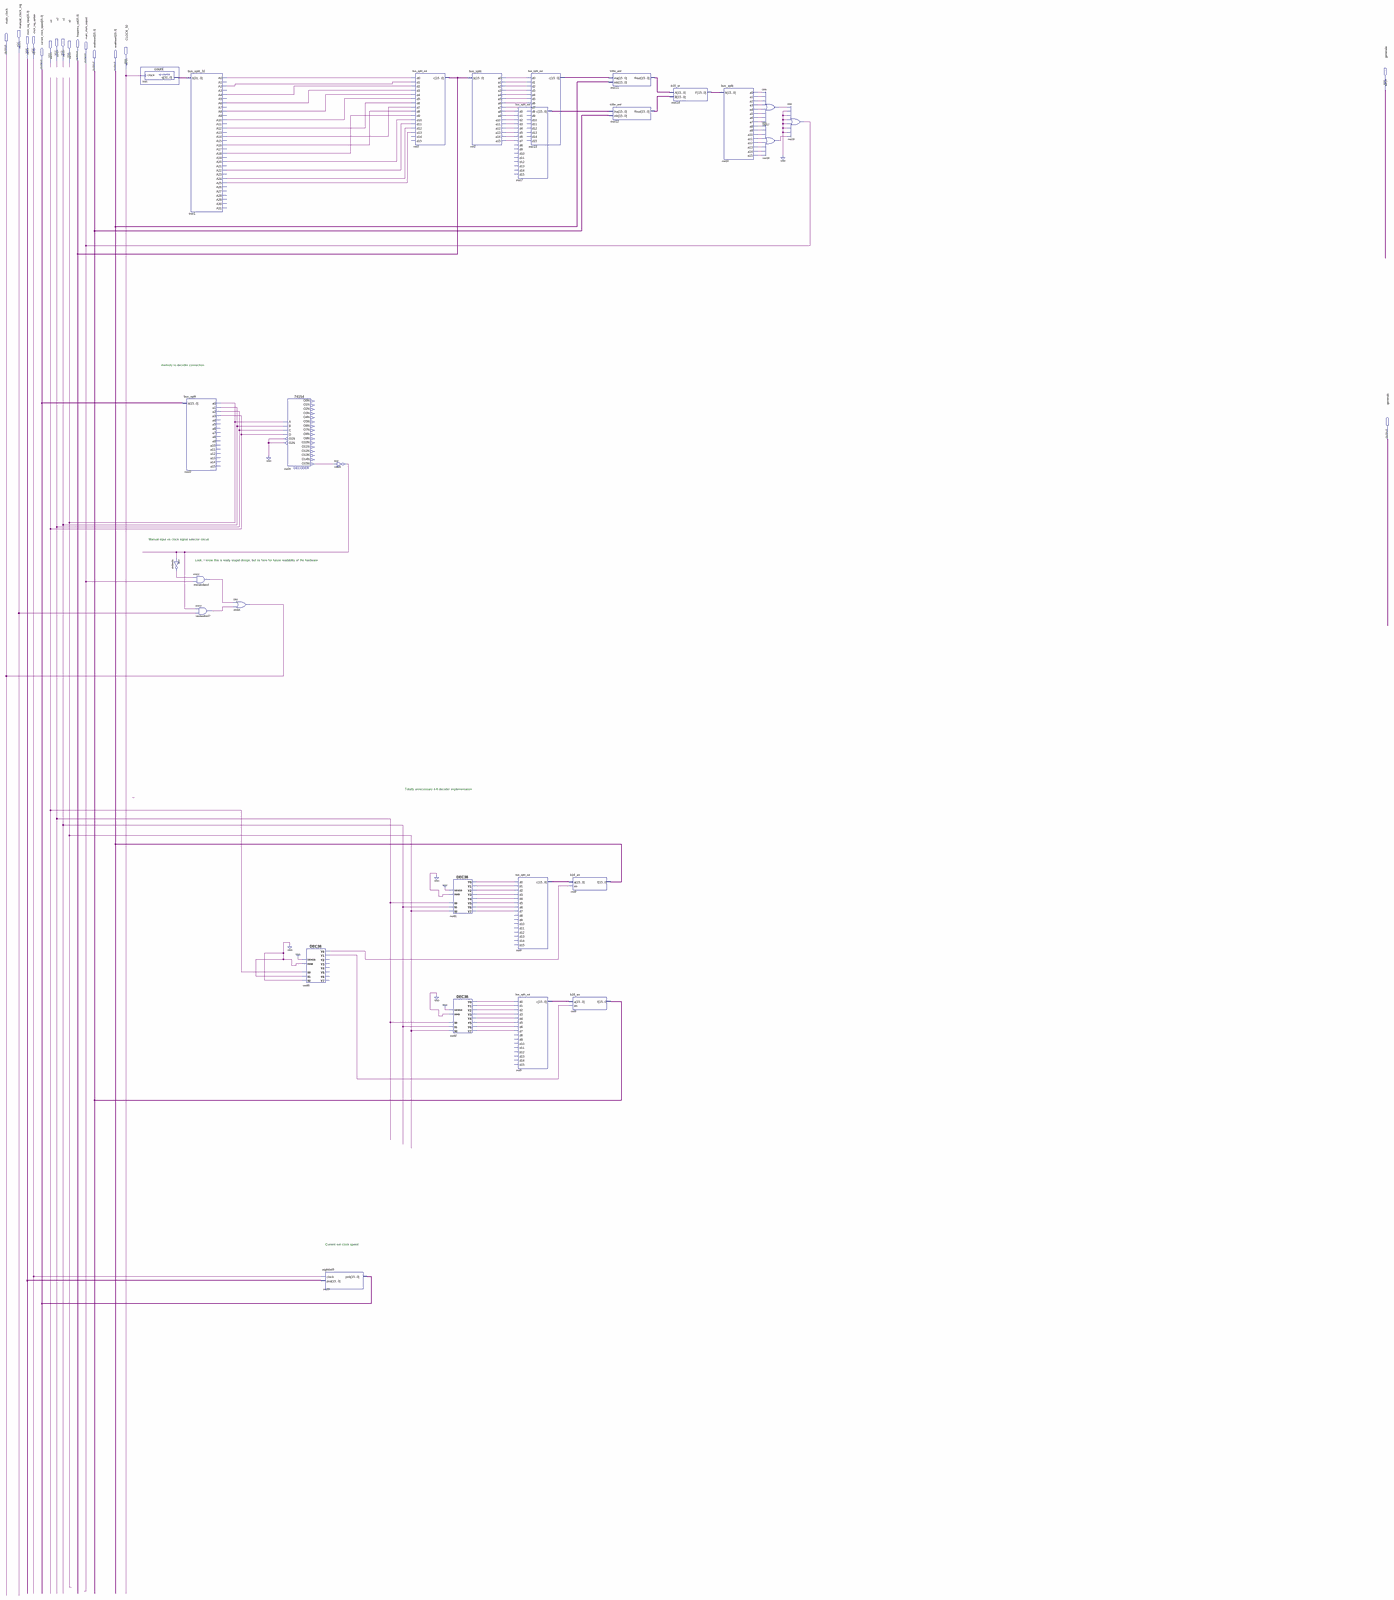
[diagram p0: schematic sheet, whole]
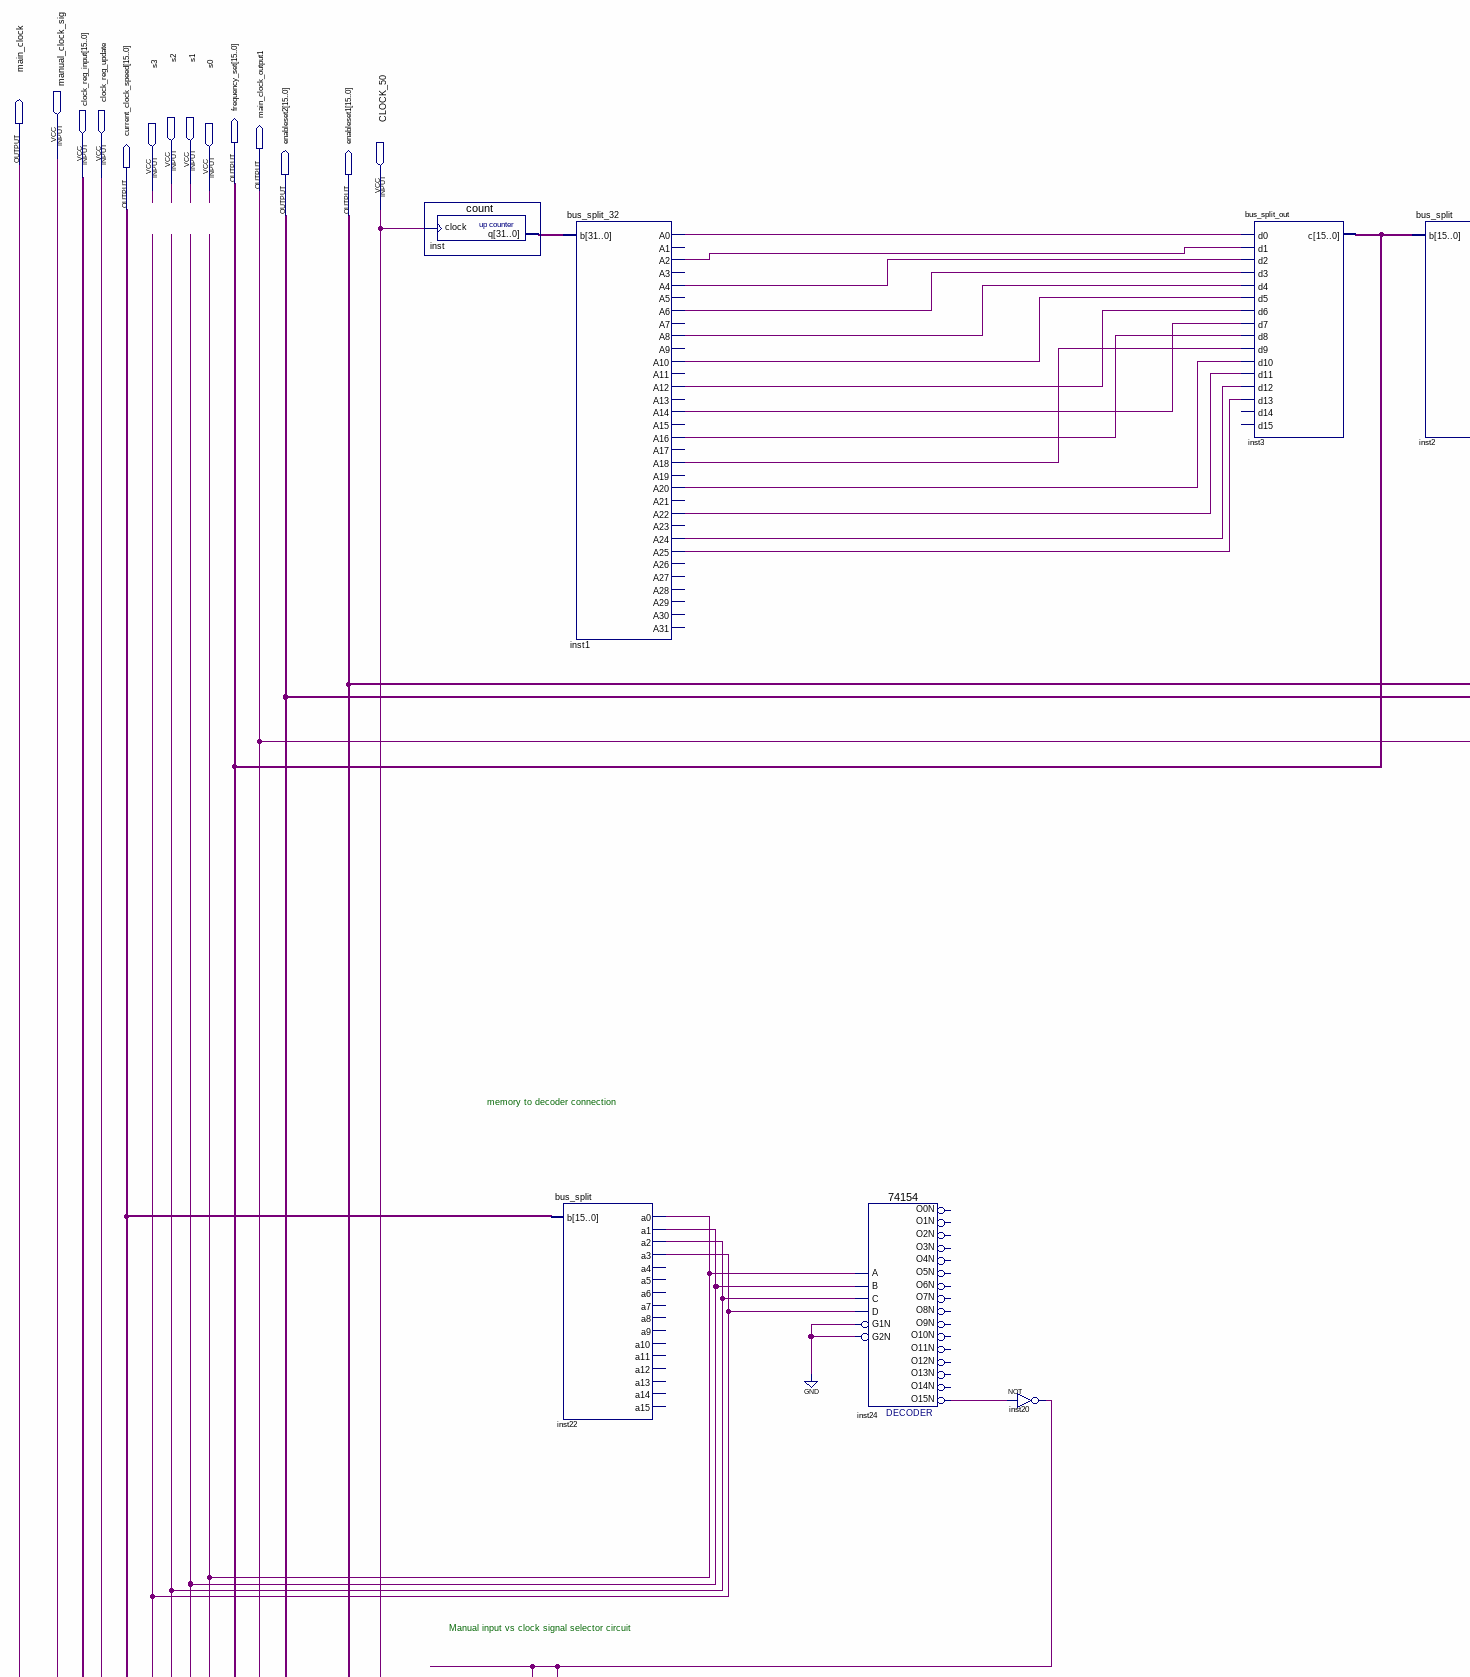
[diagram p1: schematic sheet, upper left part]
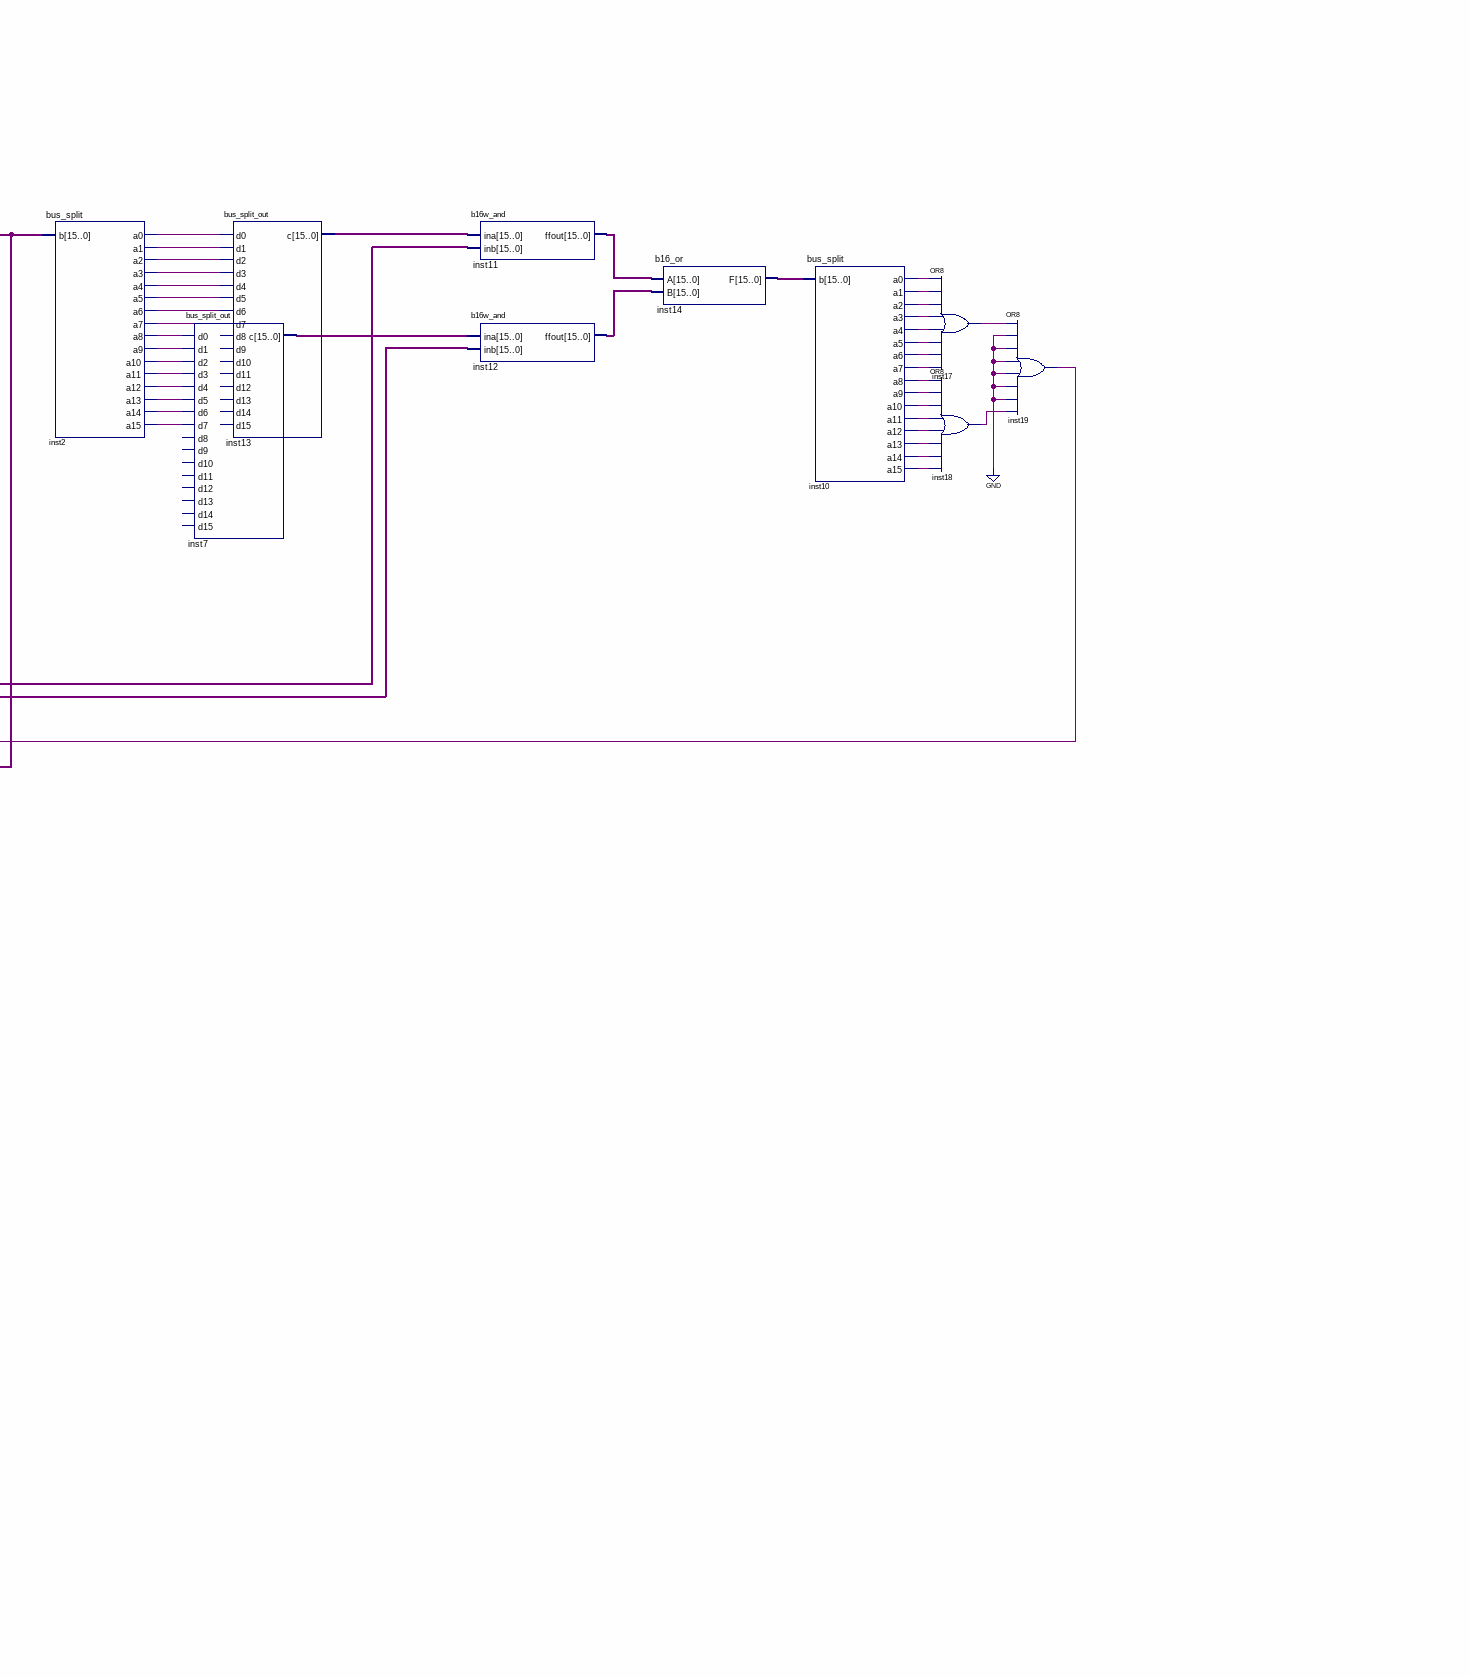
[diagram p2: schematic sheet, upper centre part]
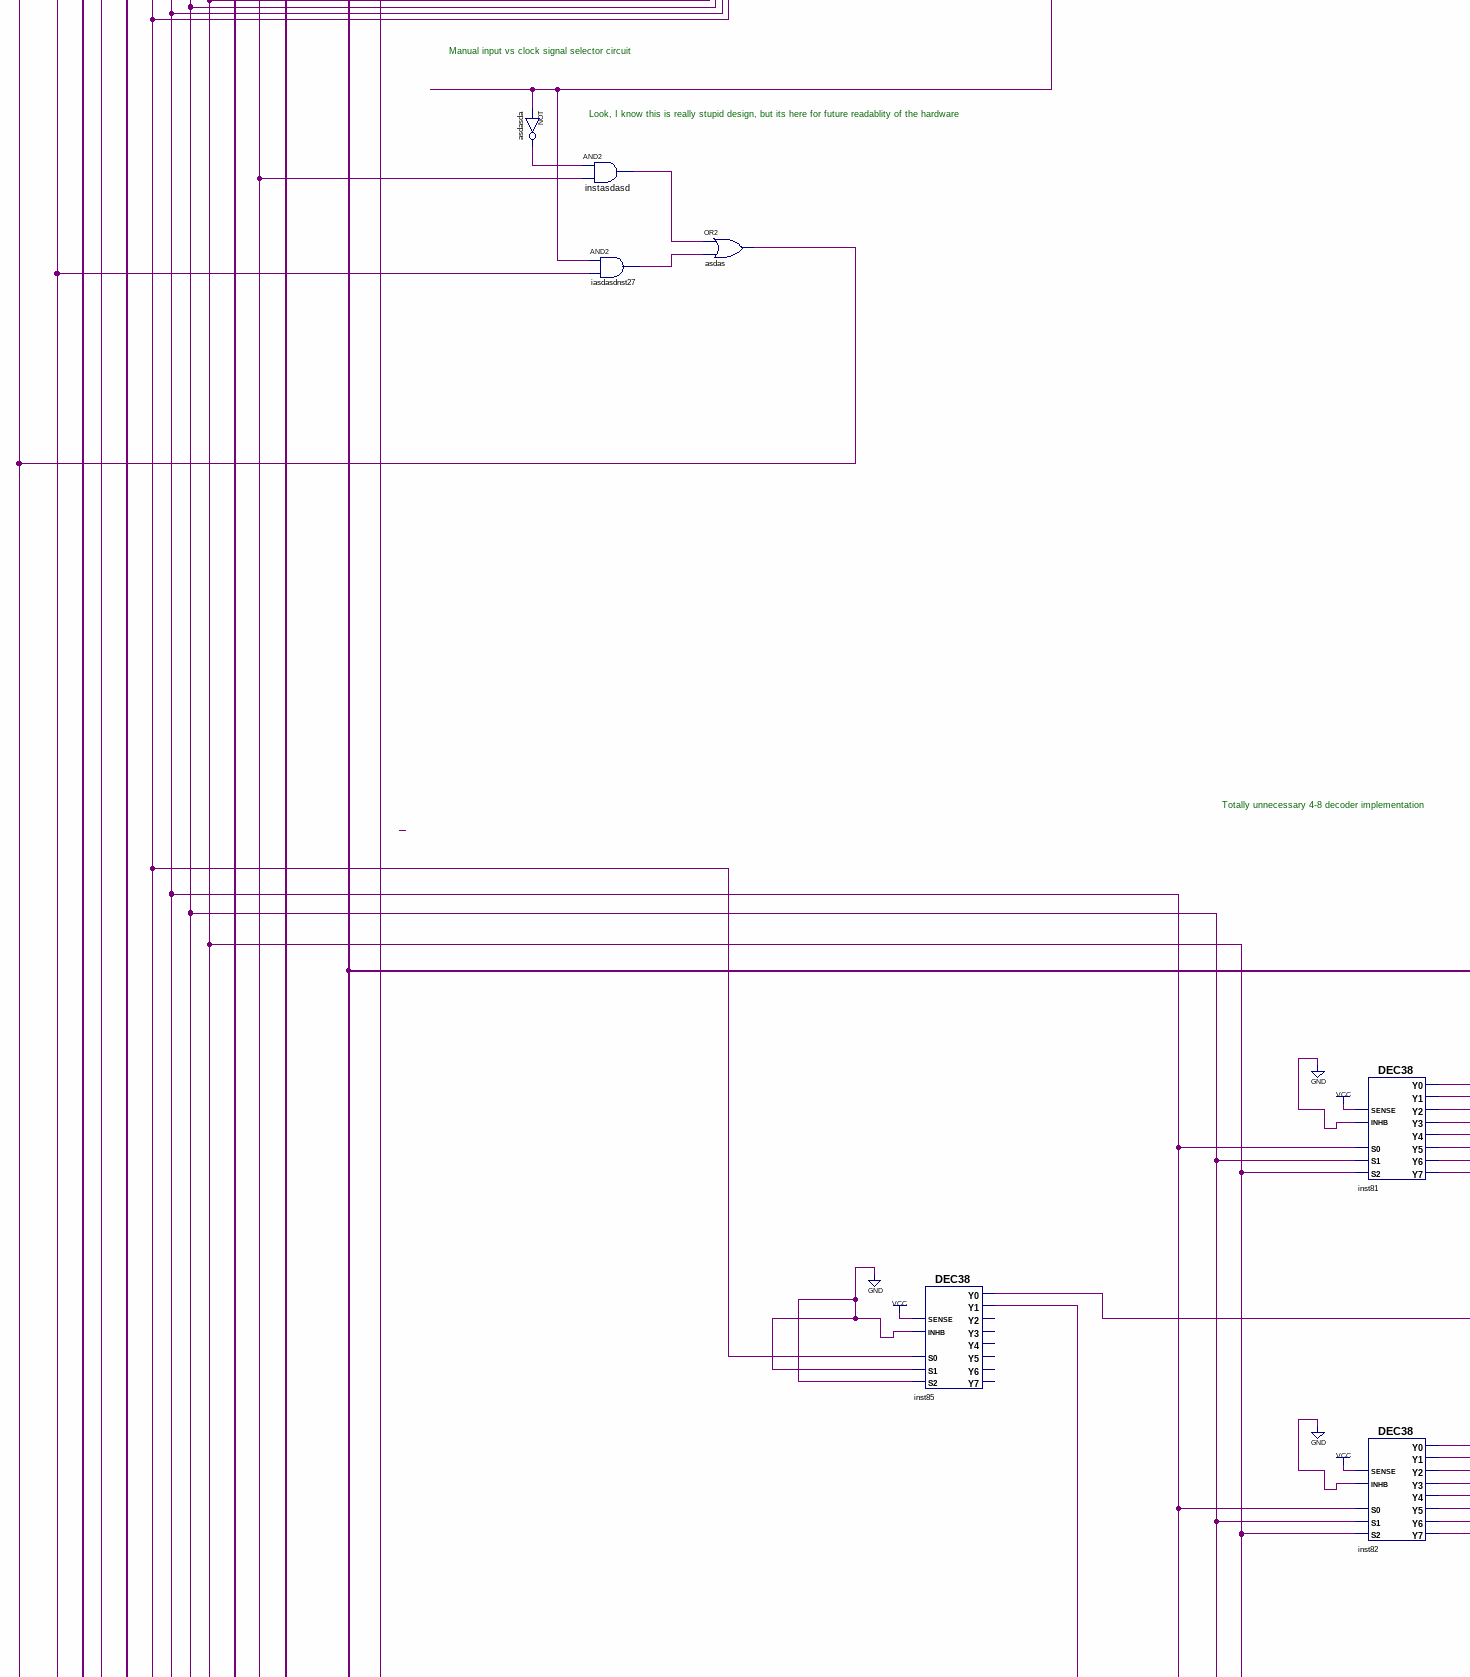
[diagram p3: schematic sheet, middle left part]
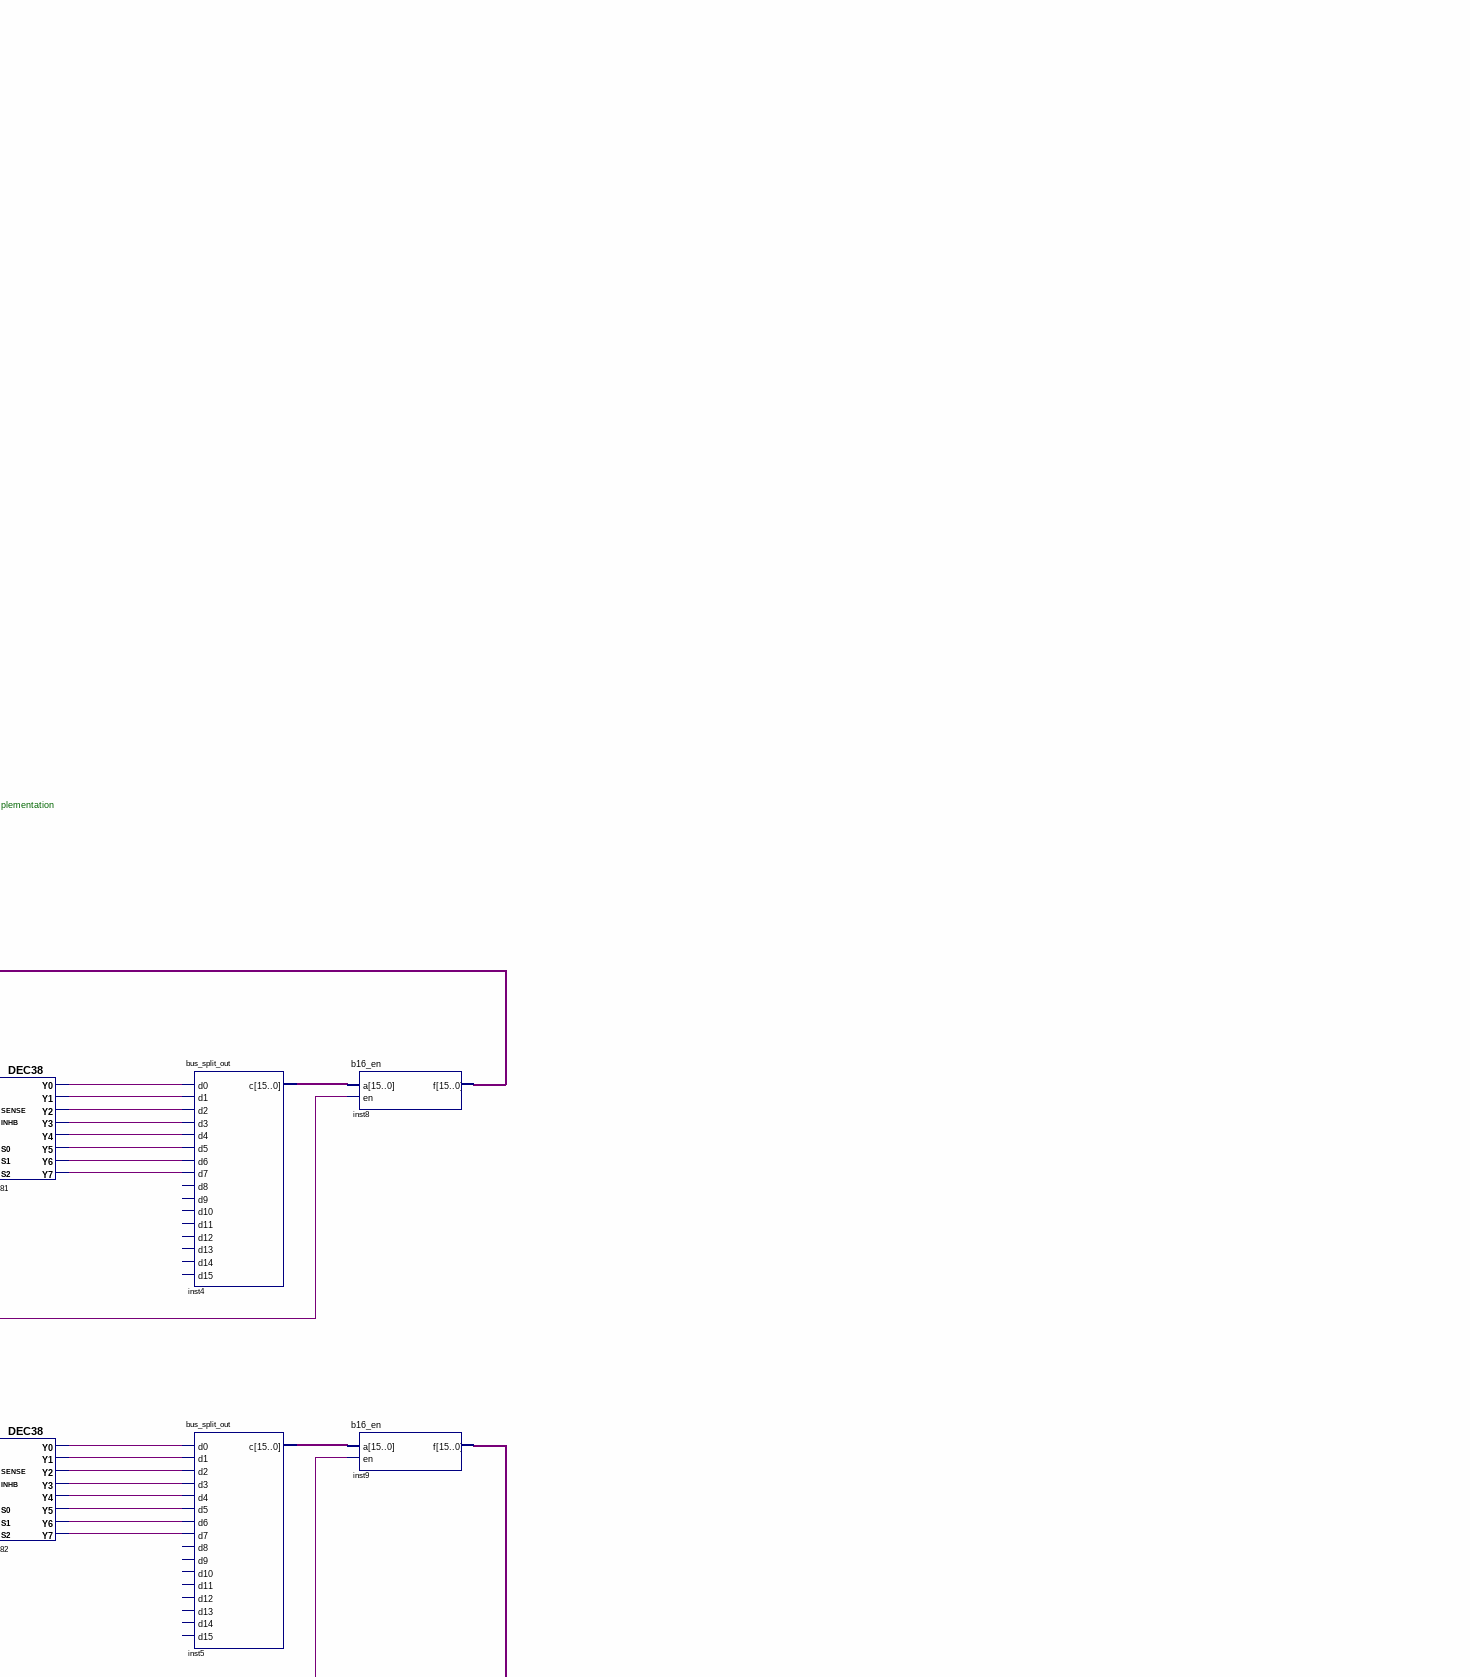
[diagram p4: schematic sheet, middle centre part]
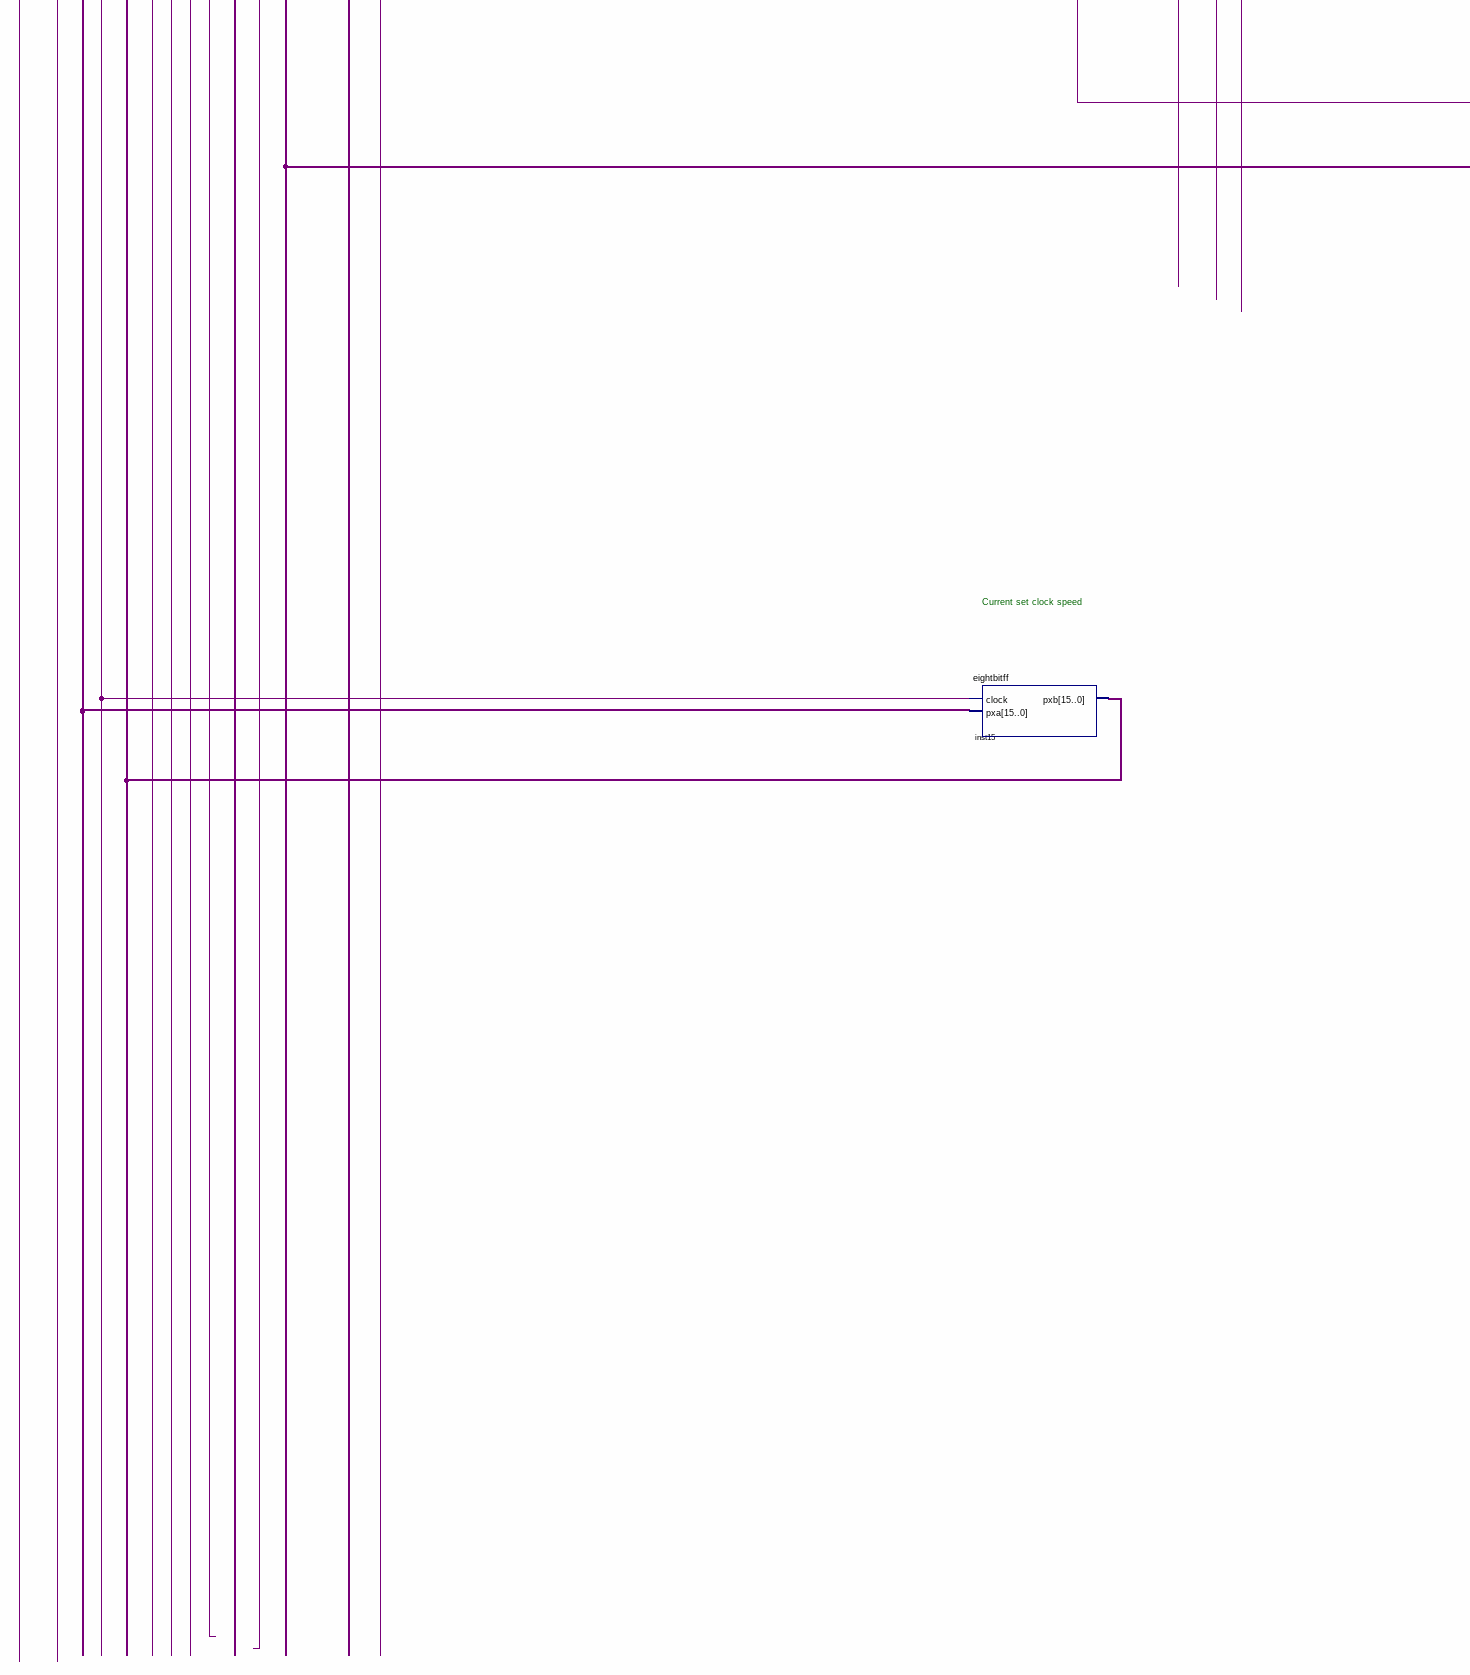
[diagram p5: schematic sheet, lower left part]
// Quartus schematic clockmod2.bdf as structural Verilog: 28 symbols, 16 pins
module clockmod2 (
  input  manual_clock_sig,
  input  [15:0] clock_reg_input,
  input  clock_reg_update,
  input  s2,
  input  s1,
  input  s3,
  input  s0,
  input  CLOCK_50,
  input  generala,
  output main_clock,
  output [15:0] frequency_set,
  output main_clock_output1,
  output [15:0] current_clock_speed,
  output [15:0] enableset2,
  output [15:0] enableset1,
  output generalc
);

  wire asdasda_out, iasdasdnst27_out, inst1_a0, inst1_a2, inst1_a4, inst1_a6, inst1_a8, inst1_a10, inst1_a12,
       inst1_a14, inst1_a16, inst1_a18, inst1_a20, inst1_a22, inst1_a24, inst1_a25, inst2_a0, inst2_a1,
       inst2_a2, inst2_a3, inst2_a4, inst2_a5, inst2_a6, inst2_a7, inst2_a8, inst2_a9, inst2_a10, inst2_a11,
       inst2_a12, inst2_a13, inst2_a14, inst2_a15, inst10_a0, inst10_a1, inst10_a2, inst10_a3, inst10_a4,
       inst10_a5, inst10_a6, inst10_a7, inst10_a8, inst10_a9, inst10_a10, inst10_a11, inst10_a12, inst10_a13,
       inst10_a14, inst10_a15, inst17_out, inst18_out, inst20_out, inst22_a0, inst22_a1, inst22_a2,
       inst22_a3, inst24_o15n, inst81_y0, inst81_y1, inst81_y2, inst81_y3, inst81_y4, inst81_y5, inst81_y6,
       inst81_y7, inst82_y0, inst82_y1, inst82_y2, inst82_y3, inst82_y4, inst82_y5, inst82_y6, inst82_y7,
       inst85_y0, inst85_y1, instasdasd_out;
  wire [15:0] inst4_c, inst5_c, inst7_c, inst11_ffout, inst12_ffout, inst13_c, inst14_f;
  wire [31:0] inst_q;

  count inst (.clock(CLOCK_50), .q(inst_q));
  not asdasda (asdasda_out, inst20_out);
  bus_split_32 inst1 (
    .b(inst_q), .A0(inst1_a0), .A2(inst1_a2), .A4(inst1_a4), .A6(inst1_a6), .A8(inst1_a8), .A10(inst1_a10),
    .A12(inst1_a12), .A14(inst1_a14), .A16(inst1_a16), .A18(inst1_a18), .A20(inst1_a20), .A22(inst1_a22),
    .A24(inst1_a24), .A25(inst1_a25));  // open: A1, A3, A5, A7, A9, A11, A13, A15, A17, A19, A21, A23, A26, A27, A28, A29, A30, A31
  bus_split inst22 (
    .b(current_clock_speed), .a0(inst22_a0), .a1(inst22_a1), .a2(inst22_a2), .a3(inst22_a3));  // open: a4, a5, a6, a7, a8, a9, a10, a11, a12, a13, a14, a15
  and instasdasd (instasdasd_out, asdasda_out, main_clock_output1);
  and iasdasdnst27 (iasdasdnst27_out, inst20_out, manual_clock_sig);
  or asdas (main_clock, instasdasd_out, iasdasdnst27_out);
  \74154  inst24 (
    .C(inst22_a2), .D(inst22_a3), .B(inst22_a1), .A(inst22_a0), .G1N(1'b0), .G2N(1'b0), .O15N(inst24_o15n));  // open: O0N, O12N, O10N, O11N, O1N, O13N, O14N, O4N, O3N, O2N, O7N, O6N, O5N, O9N, O8N
  DEC38 inst85 (
    .S2(1'b0), .S1(1'b0), .INHB(1'b0), .S0(inst22_a3), .SENSE(1'b1), .Y0(inst85_y0), .Y1(inst85_y1));  // open: Y7, Y6, Y5, Y3, Y4, Y2
  eightbitff inst15 (.clock(clock_reg_update), .pxa(clock_reg_input), .pxb(current_clock_speed));
  not inst20 (inst20_out, inst24_o15n);
  bus_split_out inst3 (
    .d0(inst1_a0), .d1(inst1_a2), .d2(inst1_a4), .d3(inst1_a6), .d4(inst1_a8), .d5(inst1_a10),
    .d6(inst1_a12), .d7(inst1_a14), .d8(inst1_a16), .d9(inst1_a18), .d10(inst1_a20), .d11(inst1_a22),
    .d12(inst1_a24), .d13(inst1_a25), .c(frequency_set));  // open: d14, d15
  DEC38 inst81 (
    .S2(inst22_a0), .S1(inst22_a1), .INHB(1'b0), .S0(inst22_a2), .SENSE(1'b1), .Y7(inst81_y7),
    .Y6(inst81_y6), .Y5(inst81_y5), .Y3(inst81_y3), .Y4(inst81_y4), .Y0(inst81_y0), .Y1(inst81_y1),
    .Y2(inst81_y2));
  DEC38 inst82 (
    .S2(inst22_a0), .S1(inst22_a1), .INHB(1'b0), .S0(inst22_a2), .SENSE(1'b1), .Y7(inst82_y7),
    .Y6(inst82_y6), .Y5(inst82_y5), .Y3(inst82_y3), .Y4(inst82_y4), .Y0(inst82_y0), .Y1(inst82_y1),
    .Y2(inst82_y2));
  bus_split inst2 (
    .b(frequency_set), .a0(inst2_a0), .a1(inst2_a1), .a2(inst2_a2), .a3(inst2_a3), .a4(inst2_a4),
    .a5(inst2_a5), .a6(inst2_a6), .a7(inst2_a7), .a8(inst2_a8), .a9(inst2_a9), .a10(inst2_a10),
    .a11(inst2_a11), .a12(inst2_a12), .a13(inst2_a13), .a14(inst2_a14), .a15(inst2_a15));
  bus_split_out inst13 (
    .d0(inst2_a0), .d1(inst2_a1), .d2(inst2_a2), .d3(inst2_a3), .d4(inst2_a4), .d5(inst2_a5), .d6(inst2_a6),
    .d7(inst2_a7), .c(inst13_c));  // open: d8, d9, d10, d11, d12, d13, d14, d15
  bus_split_out inst7 (
    .d0(inst2_a8), .d1(inst2_a9), .d2(inst2_a10), .d3(inst2_a11), .d4(inst2_a12), .d5(inst2_a13),
    .d6(inst2_a14), .d7(inst2_a15), .c(inst7_c));  // open: d8, d9, d10, d11, d12, d13, d14, d15
  bus_split_out inst4 (
    .d0(inst81_y0), .d1(inst81_y1), .d2(inst81_y2), .d3(inst81_y3), .d4(inst81_y4), .d5(inst81_y5),
    .d6(inst81_y6), .d7(inst81_y7), .c(inst4_c));  // open: d8, d9, d10, d11, d12, d13, d14, d15
  bus_split_out inst5 (
    .d0(inst82_y0), .d1(inst82_y1), .d2(inst82_y2), .d3(inst82_y3), .d4(inst82_y4), .d5(inst82_y5),
    .d6(inst82_y6), .d7(inst82_y7), .c(inst5_c));  // open: d8, d9, d10, d11, d12, d13, d14, d15
  b16_en inst8 (.a(inst4_c), .en(inst85_y0), .f(enableset1));
  b16_en inst9 (.a(inst5_c), .en(inst85_y1), .f(enableset2));
  b16w_and inst11 (.ina(inst13_c), .inb(enableset1), .ffout(inst11_ffout));
  b16w_and inst12 (.ina(inst7_c), .inb(enableset2), .ffout(inst12_ffout));
  b16_or inst14 (.A(inst11_ffout), .B(inst12_ffout), .F(inst14_f));
  bus_split inst10 (
    .b(inst14_f), .a0(inst10_a0), .a1(inst10_a1), .a2(inst10_a2), .a3(inst10_a3), .a4(inst10_a4),
    .a5(inst10_a5), .a6(inst10_a6), .a7(inst10_a7), .a8(inst10_a8), .a9(inst10_a9), .a10(inst10_a10),
    .a11(inst10_a11), .a12(inst10_a12), .a13(inst10_a13), .a14(inst10_a14), .a15(inst10_a15));
  or inst17 (inst17_out, inst10_a0, inst10_a1, inst10_a2, inst10_a3, inst10_a4, inst10_a5, inst10_a6, inst10_a7);
  or inst18 (inst18_out, inst10_a8, inst10_a9, inst10_a10, inst10_a11, inst10_a12, inst10_a13, inst10_a14, inst10_a15);
  or inst19 (main_clock_output1, inst17_out, 1'b0, 1'b0, 1'b0, 1'b0, 1'b0, 1'b0, inst18_out);

  // Notes on the sheet:
  //   memory to decoder connection
  //   Manual input vs clock signal selector circuit
  //   Look, I know this is really stupid design, but its here for future readablity of the hardware
  //   Totally unnecessary 4-8 decoder implementation 
  //   Current set clock speed
endmodule
